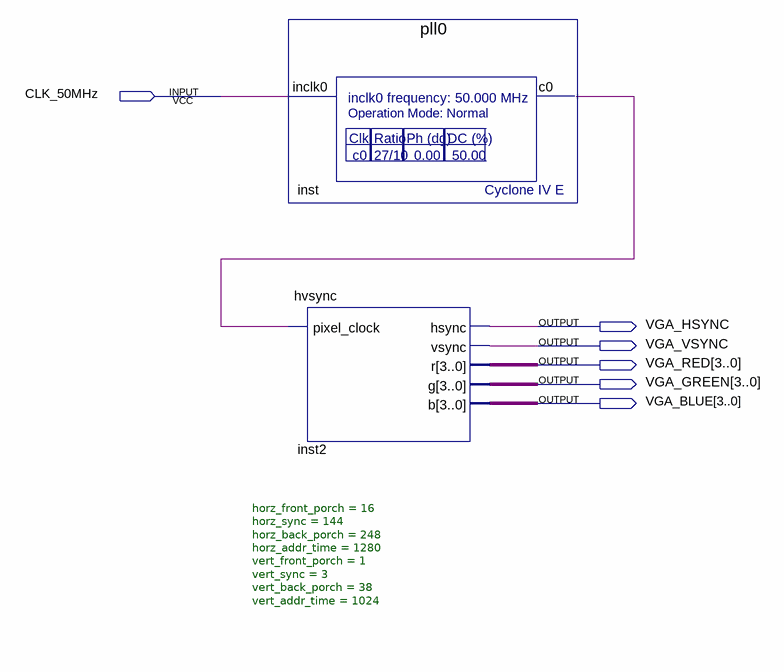
[diagram p0: schematic sheet]
// Quartus schematic cyclone4_first.bdf as structural Verilog: 2 symbols, 6 pins
module cyclone4_first (
  input  CLK_50MHz,
  output VGA_HSYNC,
  output VGA_VSYNC,
  output [3:0] VGA_RED,
  output [3:0] VGA_GREEN,
  output [3:0] VGA_BLUE
);

  wire inst_c0;

  pll0 inst (.inclk0(CLK_50MHz), .c0(inst_c0));
  hvsync #(.horz_front_porch(16), .horz_sync(144), .horz_back_porch(248), .horz_addr_time(1280), .vert_front_porch(1), .vert_sync(3), .vert_back_porch(38), .vert_addr_time(1024)) inst2 (
    .pixel_clock(inst_c0), .hsync(VGA_HSYNC), .vsync(VGA_VSYNC), .r(VGA_RED), .g(VGA_GREEN), .b(VGA_BLUE));
endmodule
